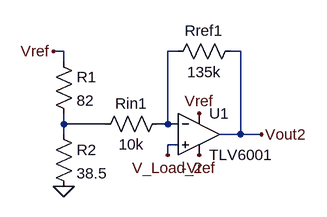
[diagram p0: schematic folding_amp_actual_old_opamp.asc]
folding_amp_actual_old_opamp.asc, the LTspice schematic file:
Version 4
SHEET 1 880 680
WIRE 64 48 48 48
WIRE 240 48 224 48
WIRE 336 48 320 48
WIRE 64 64 64 48
WIRE 64 160 64 144
WIRE 128 160 64 160
WIRE 224 160 224 48
WIRE 224 160 208 160
WIRE 240 160 224 160
WIRE 64 176 64 160
WIRE 336 176 336 48
WIRE 336 176 304 176
WIRE 368 176 336 176
WIRE 240 192 224 192
WIRE 224 208 224 192
FLAG 368 176 Vout2
FLAG 64 256 0
FLAG 224 208 V_Load_2
FLAG 48 48 Vref
FLAG 272 144 Vref
FLAG 272 208 -Vref
SYMBOL res 336 32 R90
WINDOW 0 0 56 VBottom 2
WINDOW 3 32 56 VTop 2
SYMATTR InstName Rref1
SYMATTR Value 135k
SYMBOL res 224 144 R90
WINDOW 0 0 56 VBottom 2
WINDOW 3 32 56 VTop 2
SYMATTR InstName Rin1
SYMATTR Value 10k
SYMBOL res 48 48 R0
SYMATTR InstName R1
SYMATTR Value 82
SYMBOL res 48 160 R0
SYMATTR InstName R2
SYMATTR Value 38.5
SYMBOL Opamps\\opamp2 272 112 R0
SYMATTR InstName U1
SYMATTR Value TLV6001

The netlist it stands for:
* folding_amp_actual_old_opamp.asc
Rref1 Vout2 N001 135k
Rin1 N001 N002 10k
R1 Vref N002 82
R2 N002 0 38.5
XU1 V_Load_2 N001 Vref -Vref Vout2 TLV6001  ; pins In+ In- V+ V- OUT
.backanno
.end